# Altium schematic sheet Power_Supply.SchDoc: Power Supply (part 1 of 2)
size A3; Author: M.Beldyga; CompanyName: WUT ISE; DrawnBy: M.Beldyga; Organization: WUT ISE; Address1: PW ISE; Address2: Nowowiejska 15/19 00-665 Warsaw; Address3: micbeldyga@gmail.com; SheetNumber: 2; SheetTotal: 2; ModifiedBy: -; CheckedDate: -; DivGrp: WUT ISE; Designer: M.Beldyga; ModifiedDate: -; ProjectName: Sensor Box
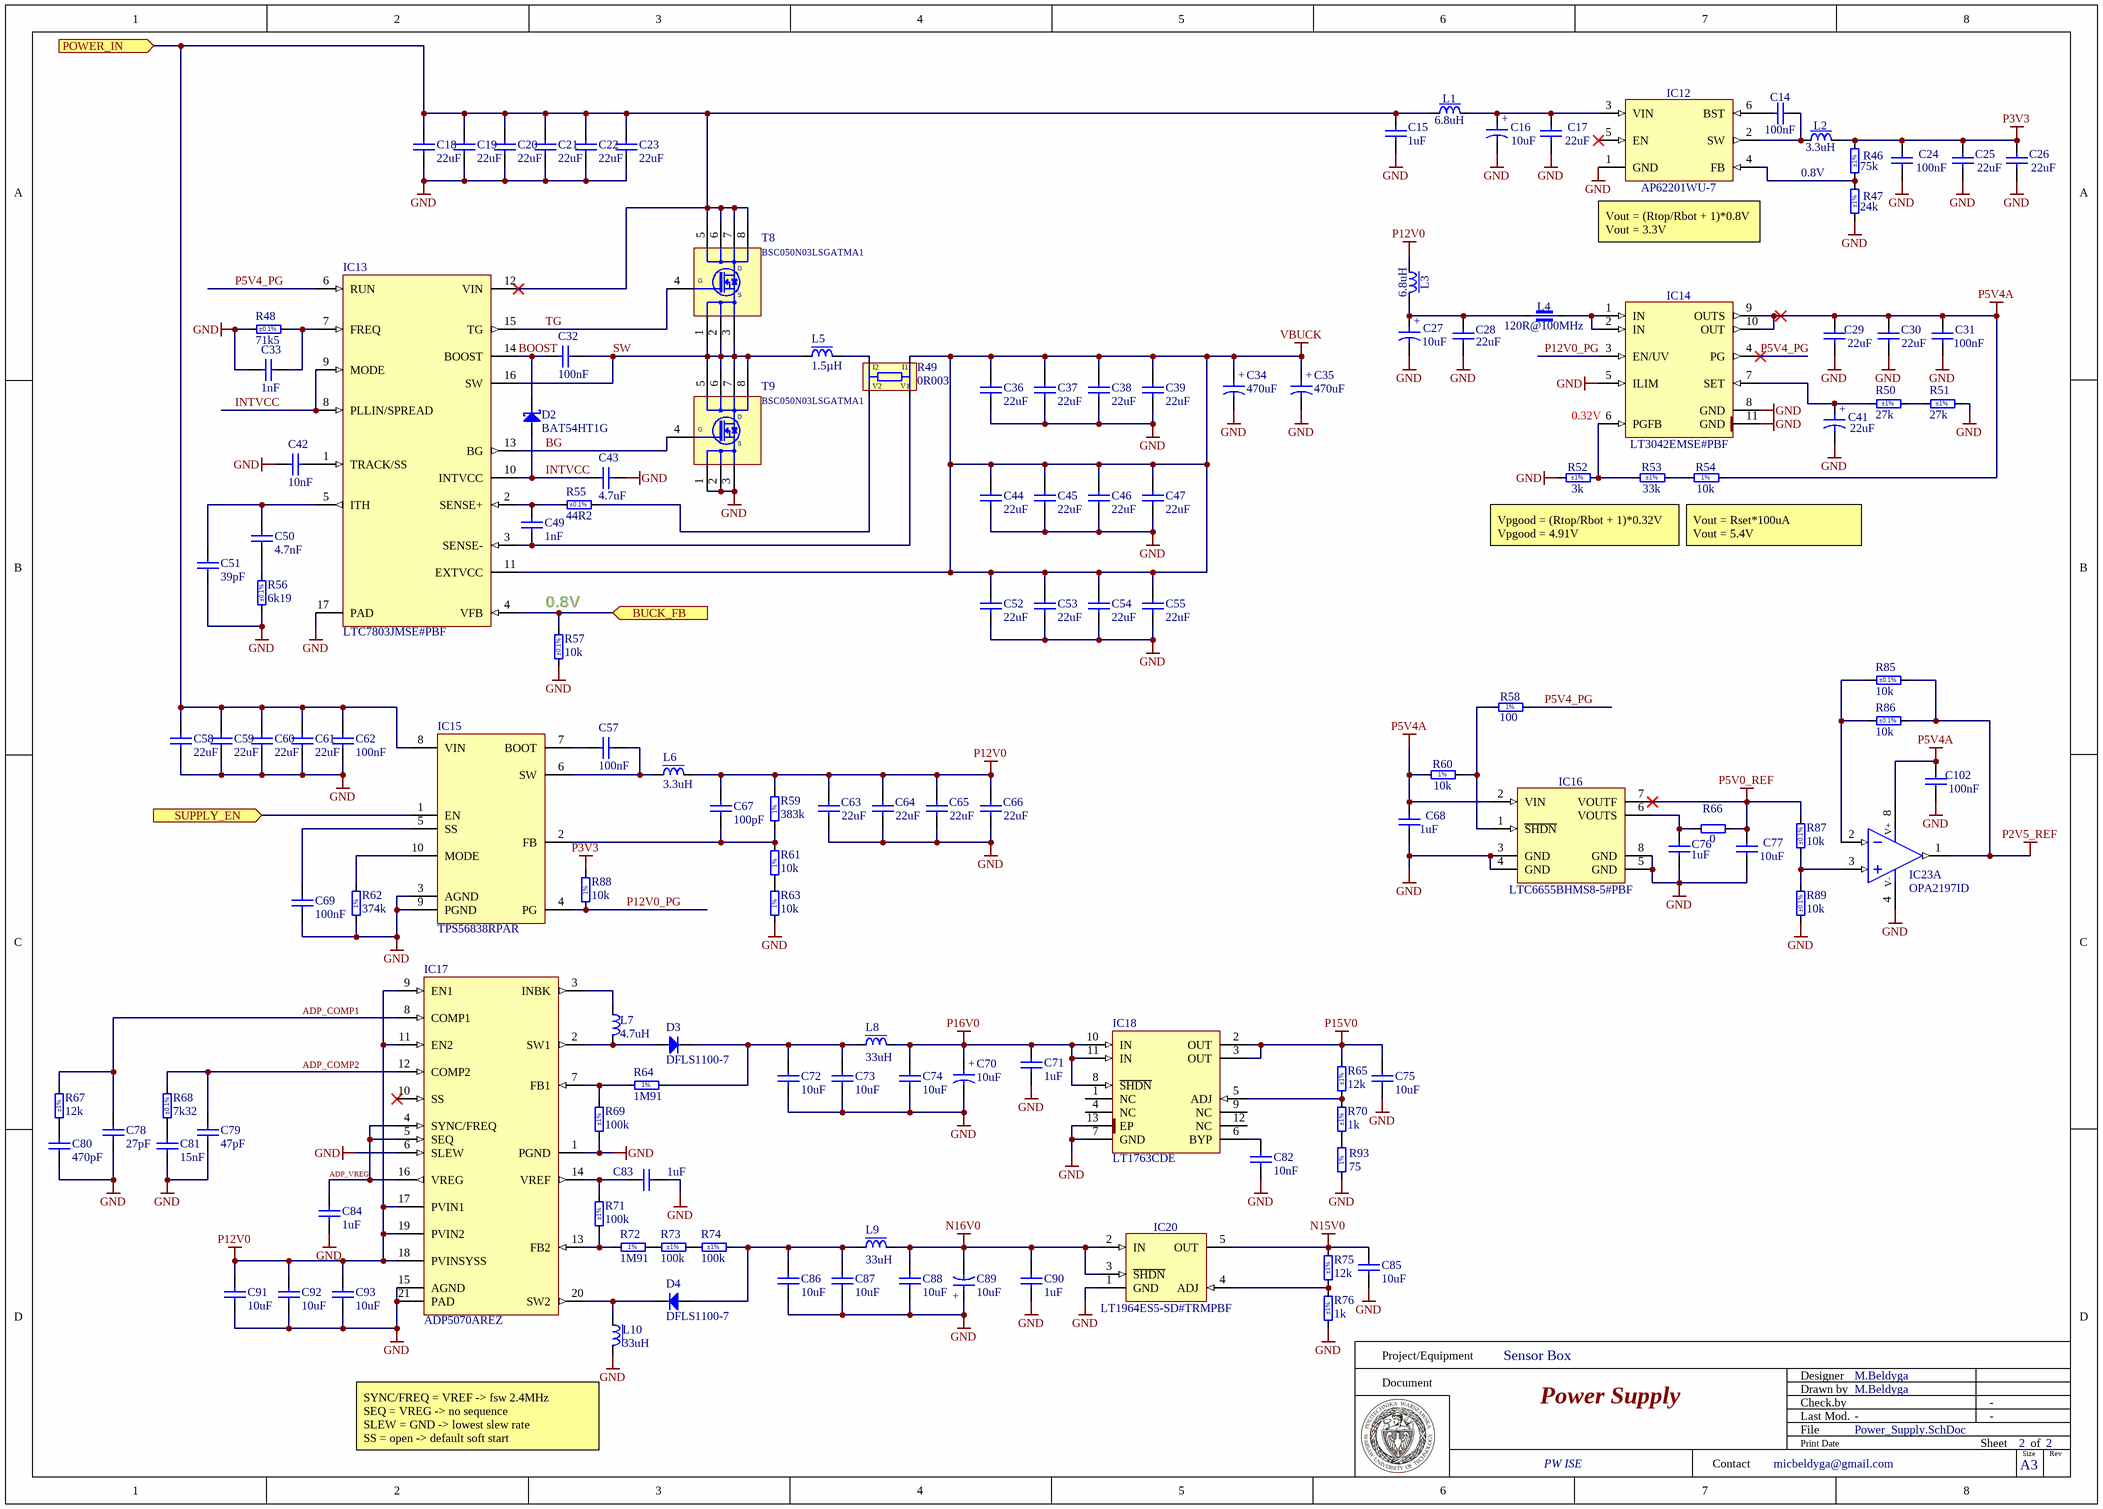
[diagram p0: Power_Supply.SchDoc]

## Parts
C14  100nF  [CAPC1005X55N]
C15  1uF  [CAPC1608X87N]
C16  10uF  [CAPMP3216X180N]
C17  22uF  [CAPC2012X135N]
C18  22uF  [CAPC3216X180N]
C19  22uF  [CAPC3216X180N]
C20  22uF  [CAPC3216X180N]
C21  22uF  [CAPC3216X180N]
C22  22uF  [CAPC3216X180N]
C23  22uF  [CAPC3216X180N]
C24  100nF  [CAPC1005X55N]
C25  22uF  [CAPC2012X135N]
C26  22uF  [CAPC2012X135N]
C27  10uF  [CAPMP3216X180N]
C28  22uF  [CAPC2012X135N]
C29  22uF  [CAPC2012X135N]
C30  22uF  [CAPC2012X135N]
C31  100nF  [CAPC1005X55N]
C32  100nF  [CAPC1005X55N]
C33  1nF  [CAPC1005X55N]
C34  470uF  [CAPAE1030X1020N]
C35  470uF  [CAPAE1030X1020N]
C36  22uF  [CAPC3216X180N]
C37  22uF  [CAPC3216X180N]
C38  22uF  [CAPC3216X180N]
C39  22uF  [CAPC3216X180N]
C41  22uF  [CAPMP3528X210N]
C42  10nF  [CAPC1005X55N]
C43  4.7uF  [CAPC1005X55N]
C44  22uF  [CAPC3216X180N]
C45  22uF  [CAPC3216X180N]
C46  22uF  [CAPC3216X180N]
C47  22uF  [CAPC3216X180N]
C49  1nF  [CAPC1005X55N]
C50  4.7nF  [CAPC1005X55N]
C51  39pF  [CAPC1005X55N]
C52  22uF  [CAPC3216X180N]
C53  22uF  [CAPC3216X180N]
C54  22uF  [CAPC3216X180N]
C55  22uF  [CAPC3216X180N]
C57  100nF  [CAPC1005X55N]
C58  22uF  [CAPC3216X180N]
C59  22uF  [CAPC3216X180N]
C60  22uF  [CAPC3216X180N]
C61  22uF  [CAPC3216X180N]
C62  100nF  [CAPC1005X55N]
C63  22uF  [CAPC2012X135N]
C64  22uF  [CAPC2012X135N]
C65  22uF  [CAPC2012X135N]
C66  22uF  [CAPC2012X135N]
C67  100pF  [CAPC1005X55N]
C68  1uF  [CAPC1608X87N]
C69  100nF  [CAPC1005X55N]
C70  10uF  [CAPMP3216X180N]
C71  1uF  [CAPC1608X87N]
C72  10uF  [CAPC1709X100N]
C73  10uF  [CAPC1709X100N]
C74  10uF  [CAPC1709X100N]
C75  10uF  [CAPC1709X100N]
C76  1uF  [CAPC1608X87N]
C77  10uF  [CAPC1608X80N]
C78  27pF  [CAPC1005X55N]
C79  47pF  [CAPC1005X55N]
C80  470pF  [CAPC1005X55N]
C81  15nF  [CAPC1005X55N]
C82  10nF  [CAPC1005X55N]
C83  1uF  [CAPC1608X87N]
C84  1uF  [CAPC1608X87N]
C85  10uF  [CAPC1709X100N]
C86  10uF  [CAPC1709X100N]
C87  10uF  [CAPC1709X100N]
C88  10uF  [CAPC1709X100N]
C89  10uF  [CAPMP3216X180N]
C90  1uF  [CAPC1608X87N]
C91  10uF  [CAPC1709X100N]
C92  10uF  [CAPC1709X100N]
C93  10uF  [CAPC1709X100N]
C102  100nF  [CAPC1005X55N]
D2  BAT54HT1G  [SOD2513X100N]
D3  DFLS1100-7  [DIODES-INC_POWERDI123]
D4  DFLS1100-7  [DIODES-INC_POWERDI123]
IC12  AP62201WU-7  [SOT95P280X100-6N]
IC13  LTC7803JMSE#PBF  [TSSOP50P490X86_HS-17N]
IC14  LT3042EMSE#PBF  [SOP50P490X110-11N-R168X198]
IC15  TPS56838RPAR  [RPA0010A]
IC16  LTC6655BHMS8-5#PBF  [SOP65P490X110-8N]
IC17  ADP5070AREZ  [SOP65P640X120-21N-R305X425]
IC18  LT1763CDE  [SON50P300X400X80-13N-R180X340]
IC20  LT1964ES5-SD#TRMPBF  [SOT95P280X100-5N]
IC23  OPA2197ID  [SOIC127P600X175-8N]  (part A of 2)
L1  6.8uH  [IND_COILCRAFT_XAL4030]
L2  3.3uH  [IND_WURTH_WE-TPC_4828]
L3  6.8uH  [IND_COILCRAFT_XAL4030]
L4  120R@100MHz  [INDC1608X65N]
L5  1.5µH  [SPM10065VT-1R5M-D]
L6  3.3uH  [IND_WURTH_WE-PD_7332(METAL)]
L7  4.7uH  [IND_COILCRAFT_EPL3015]
L8  33uH  [IND_WURTH_WE-TPC_4828]
L9  33uH  [IND_WURTH_WE-TPC_4828]
L10  33uH  [IND_WURTH_WE-TPC_4828]
R46  75k  Tolerance: ±1%  [RESC1608X55N]
R47  24k  Tolerance: ±1%  [RESC1608X55N]
R48  71k5  Tolerance: ±0.1%  [RESC1608X55N]
R49  0R003  [RES_OHMITE_LVK25]
R50  27k  Tolerance: ±1%  [RESC1005X40N]
R51  27k  Tolerance: ±1%  [RESC1005X40N]
R52  3k  Tolerance: ±1%  [RESC1005X40N]
R53  33k  Tolerance: ±1%  [RESC1608X55N]
R54  10k  [RESC1005X40N]
R55  44R2  Tolerance: ±0.1%  [RESC1608X55N]
R56  6k19  Tolerance: ±0.1%  [RESC1608X55N]
R57  10k  Tolerance: ±0.1%  [RESC1005X35N]
R58  100  [RESC1005X40N]
R59  383k  [RESC1005X40N]
R60  10k  [RESC1005X40N]
R61  10k  [RESC1005X40N]
R62  374k  [RESC1005X40N]
R63  10k  [RESC1005X40N]
R64  1M91  [RESC1005X40N]
R65  12k  Tolerance: ±1%  [RESC1005X40N]
R66  0  [RESC1005X40N]
R67  12k  Tolerance: ±1%  [RESC1005X40N]
R68  7k32  Tolerance: ±0.1%  [RESC1608X55N]
R69  100k  Tolerance: ±1%  [RESC1005X40N]
R70  1k  Tolerance: ±1%  [RESC1005X40N]
R71  100k  Tolerance: ±1%  [RESC1005X40N]
R72  1M91  [RESC1005X40N]
R73  100k  Tolerance: ±1%  [RESC1005X40N]
R74  100k  Tolerance: ±1%  [RESC1005X40N]
R75  12k  Tolerance: ±1%  [RESC1005X40N]
R76  1k  Tolerance: ±1%  [RESC1005X40N]
R85  10k  Tolerance: ±0.1%  [RESC1005X35N]
R86  10k  Tolerance: ±0.1%  [RESC1005X35N]
R87  10k  Tolerance: ±0.1%  [RESC1005X35N]
R88  10k  [RESC1005X40N]
R89  10k  Tolerance: ±0.1%  [RESC1005X35N]
R93  75  [RESC1005X40N]
T8  BSC050N03LSGATMA1  [INFINEON_PG-TDSON-8]
T9  BSC050N03LSGATMA1  [INFINEON_PG-TDSON-8]

## Ports
BUCK_FB (in), POWER_IN (in), SUPPLY_EN (in)

## Nets
GND: C15.1 C16.2 C17.1 C18.1 C19.1 C20.1 C21.1 C22.1 C23.1 C24.1 C25.1 C26.1 C27.2 C28.1 C29.1 C30.1 C31.1 C33.1 C34.2 C35.2 C36.1 C37.1 C38.1 C39.1 C41.2 C42.1 C43.2 C44.1 C45.1 C46.1 C47.1 C51.1 C52.1 C53.1 C54.1 C55.1 C58.1 C59.1 C60.1 C61.1 C62.2 C63.1 C64.1 C65.1 C66.1 C68.1 C69.2 C70.2 C71.1 C72.1 C73.1 C74.1 C75.1 C76.1 C77.1 C78.1 C79.1 C80.1 C81.1 C82.1 C83.1 C84.1 C85.1 C86.1 C87.1 C88.1 C89.1 C90.1 C91.1 C92.1 C93.1 C102.1 IC12.1(GND) IC13.17(PAD) IC14.5(ILIM) IC14.8(GND) IC14.11(GND) IC15.3(AGND) IC15.9(PGND) IC16.3(GND) IC16.4(GND) IC16.5(GND) IC16.8(GND) IC17.1(PGND) IC17.6(SLEW) IC17.15(AGND) IC17.21(PAD) IC18.7(GND) IC18.13(EP) IC20.1(GND) IC23.4(V-) L10.2 R47.1 R48.1 R51.2 R52.1 R56.1 R57.1 R62.1 R63.1 R69.1 R76.1 R89.1 R93.1 T9.1(S) T9.2(S) T9.3(S)
N15V0: C85.2 IC20.5(OUT) R75.2
N16V0: C88.2 C89.2 C90.2 IC20.2(IN) IC20.3(~{SHDN}) L9.2
P2V5_REF: IC23.1(OUT) R85.1 R86.1
P3V3: C24.2 C25.2 C26.2 L2.2 R46.2 R88.2
P5V0_REF: C77.2 IC16.7(VOUTF) R66.2 R87.2
P5V4A: C29.2 C30.2 C31.2 C68.2 C102.2 IC14.9(OUTS) IC14.10(OUT) IC16.2(VIN) IC23.8(V+) R54.2 R60.1
P12V0: C63.2 C64.2 C65.2 C66.2 C67.2 C91.2 C92.2 C93.2 IC17.9(EN1) IC17.11(EN2) IC17.17(PVIN1) IC17.18(PVINSYSS) IC17.19(PVIN2) L3.1 L6.2 R59.2
P15V0: C75.2 IC18.2(OUT) IC18.3(OUT) R65.2
P16V0: C70.1 C71.2 C74.2 IC18.8(~{SHDN}) IC18.10(IN) IC18.11(IN) L8.2
VBUCK: C34.1 C35.1 C36.2 C37.2 C38.2 C39.2 C44.2 C45.2 C46.2 C47.2 C52.2 C53.2 C54.2 C55.2 IC13.11(EXTVCC) R49.I1
ADP_COMP1: C78.2 IC17.8(COMP1) R67.2
ADP_COMP2: C79.2 IC17.12(COMP2) R68.2
ADP_VREG: C84.2 IC17.4(SYNC/FREQ) IC17.5(SEQ) IC17.16(VREG)
BG: IC13.13(BG) T9.4(G)
BOOST: C32.2 D2.1(C) IC13.14(BOOST)
BUCK_FB: IC13.4(VFB) R57.2 ; port BUCK_FB
INTVCC: C43.1 D2.2(A) IC13.8(PLLIN/SPREAD) IC13.9(MODE) IC13.10(INTVCC)
P5V4_PG: IC13.6(RUN) IC14.4(PG) R58.2
P12V0_PG: IC14.3(EN/UV) IC15.4(PG) R88.1
POWER_IN: C15.2 C18.2 C19.2 C20.2 C21.2 C22.2 C23.2 C58.2 C59.2 C60.2 C61.2 C62.1 IC13.12(VIN) IC15.8(VIN) L1.1 T8.D ; port POWER_IN
SUPPLY_EN: IC15.1(EN) ; port SUPPLY_EN
SW: C32.1 IC13.16(SW) L5.1 T8.1(S) T8.2(S) T8.3(S) T9.D
TG: IC13.15(TG) T8.4(G)
NetC14_1: C14.1 IC12.6(BST)
NetC14_2: C14.2 IC12.2(SW) L2.1
NetC16_1: C16.1 C17.2 IC12.3(VIN) L1.2
NetC27_1: C27.1 C28.2 L3.2 L4.1
NetC33_2: C33.2 IC13.7(FREQ) R48.2
NetC41_1: C41.1 IC14.7(SET) R50.1
NetC42_2: C42.2 IC13.1(TRACK/SS)
NetC49_1: C49.1 IC13.3(SENSE-) R49.V1
NetC49_2: C49.2 IC13.2(SENSE+) R55.1
NetC50_1: C50.1 R56.2
NetC50_2: C50.2 C51.2 IC13.5(ITH)
NetC57_1: C57.1 IC15.6(SW) L6.1
NetC57_2: C57.2 IC15.7(BOOT)
NetC67_1: C67.1 IC15.2(FB) R59.1 R61.2
NetC69_1: C69.1 IC15.5(SS)
NetC72_2: C72.2 C73.2 D3.1(C) L8.1 R64.2
NetC76_2: C76.2 IC16.6(VOUTS) R66.1
NetC80_2: C80.2 R67.1
NetC81_2: C81.2 R68.1
NetC82_2: C82.2 IC18.6(BYP)
NetC83_2: C83.2 IC17.14(VREF) R71.2
NetC86_2: C86.2 C87.2 D4.2(A) L9.1 R74.1
NetD3_2: D3.2(A) IC17.2(SW1) L7.2
NetD4_1: D4.1(C) IC17.20(SW2) L10.1
NetIC12_4: IC12.4(FB) R46.1 R47.2
NetIC14_1: IC14.1(IN) IC14.2(IN) L4.2
NetIC14_6: IC14.6(PGFB) R52.2 R53.1
NetIC15_10: IC15.10(MODE) R62.2
NetIC16_1: IC16.1(~{SHDN}) R58.1 R60.2
NetIC17_3: IC17.3(INBK) L7.1
NetIC17_7: IC17.7(FB1) R64.1 R69.2
NetIC17_13: IC17.13(FB2) R71.1 R72.1
NetIC18_5: IC18.5(ADJ) R65.1 R70.2
NetIC20_4: IC20.4(ADJ) R75.1 R76.2
NetIC23_2: IC23.2(IN-) R85.2 R86.2
NetIC23_3: IC23.3(IN+) R87.1 R89.2
NetL5_2: L5.2 R49.I2
NetR49_V2: R49.V2 R55.2
NetR50_2: R50.2 R51.1
NetR53_2: R53.2 R54.1
NetR61_1: R61.1 R63.2
NetR70_1: R70.1 R93.2
NetR72_2: R72.2 R73.2
NetR73_1: R73.1 R74.2

Not connected (* = marked no-connect by the designer): IC12 5(EN)*; IC17 10(SS)*; IC18 1(NC) 4(NC) 9(NC) 12(NC)

## Notes on the sheet
- 0.8V
- (near IC12) Vout = (Rtop/Rbot + 1)*0.8V
  Vout = 3.3V
- (near IC14) 0.32V
- Vpgood = (Rtop/Rbot + 1)*0.32V
  Vpgood = 4.91V
- Vout = Rset*100uA
  Vout = 5.4V
- (near R57) 0.8V
- (near L10) SYNC/FREQ = VREF -> fsw 2.4MHz
  SEQ = VREG -> no sequence
  SLEW = GND -> lowest slew rate
  SS = open -> default soft start
- Project/Equipment
- Document
- Designer
- Drawn by
- Check.by
- Contact
- File
- Last Mod.
- Print Date
- Sheet
- Size
- A3
- of
- Rev
- (in symbol BSC050N03LSGATMA1) 5; 6; 7
- (in symbol CAE1030-1020_470UF_25V_20%) +
- (in symbol CTE3216-18_10UF_16V_20%_AVX_TCJ) +
- (in symbol CTE3528-21_22UF_10V_10%_LESR0700) +
- (in symbol R0402_10K_1%_0.0625W_100PPM) 1%
- (in symbol R0402_75R_1%_0.0625W_100PPM) 1%
- (in symbol R0402_100R_1%_0.0625W_100PPM) 1%